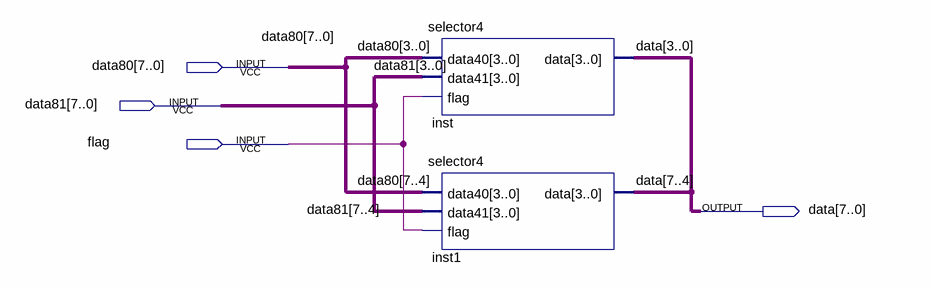
[diagram p0: schematic sheet]
// Quartus schematic selector8.bdf as structural Verilog: 2 symbols, 4 pins
module selector8 (
  input  [7:0] data80,
  input  [7:0] data81,
  input  flag,
  output [7:0] data
);

  selector4 inst (.data40(data80[3:0]), .data41(data81[3:0]), .flag(flag), .data(data[3:0]));
  selector4 inst1 (.data40(data80[7:4]), .data41(data81[7:4]), .flag(flag), .data(data[7:4]));
endmodule
